# EAGLE schematic 1WireStamp-V01-006 (EAGLE 9.3.0)
MAPLE-CUx Large Version
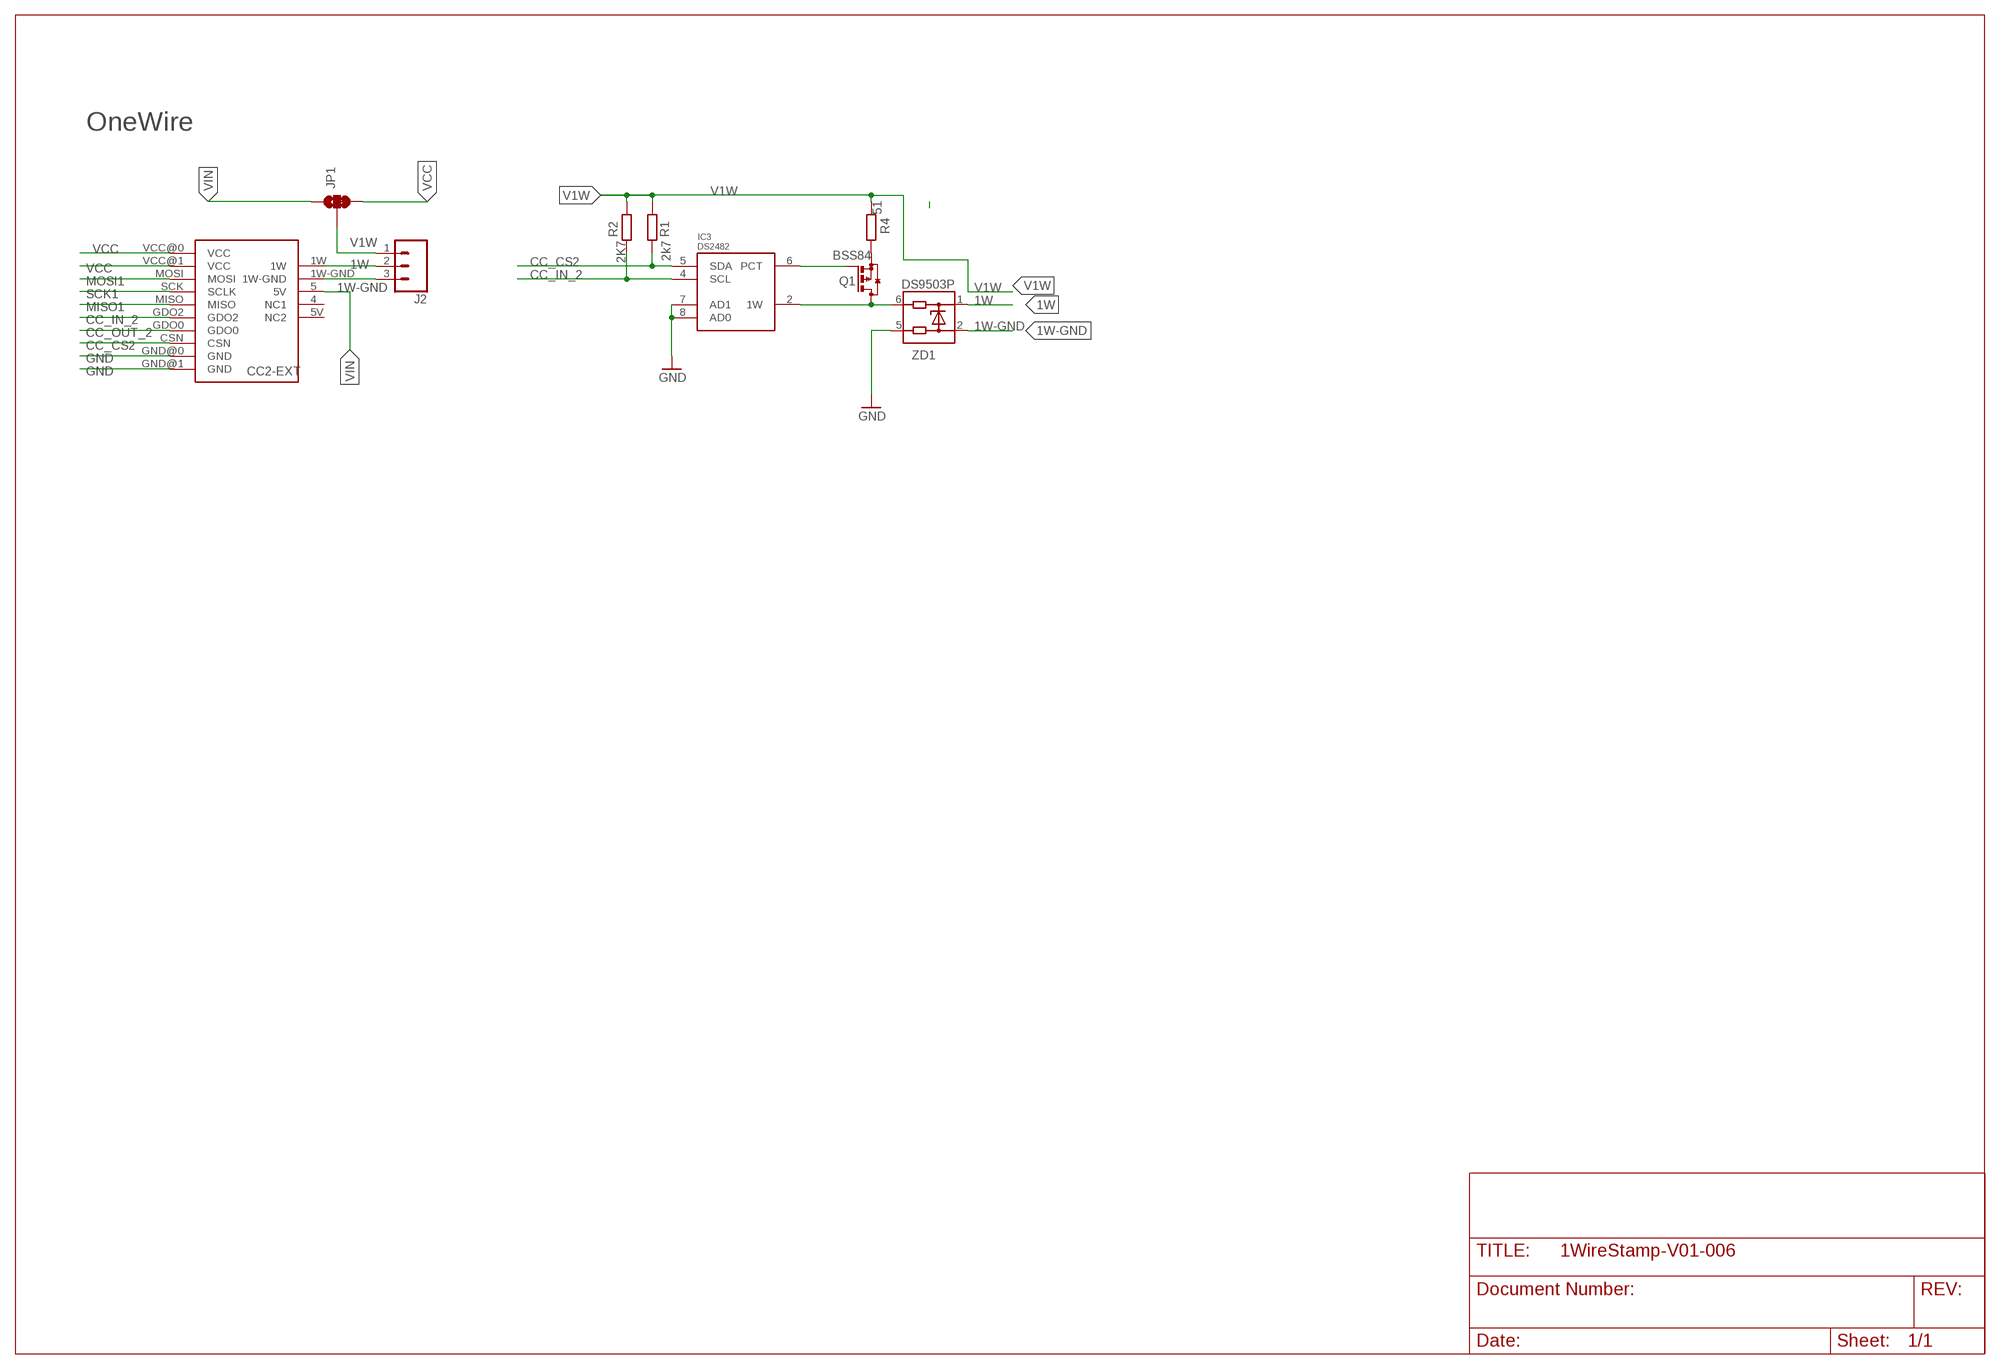
[diagram p0: schematic, sheet 1]

## Parts
CC2-EXT  ONEWIRE-MODULEONEWIRE_CC1101_WO-SILK  [ONEWIRE_CC1101_MOD_WO_SILK]
IC3  DS2482  DS2482-100S  [SO08]
J2  CONN_03LONGPADS  [1X03_LONGPADS]
JP1  JUMPER-SMT_3_1-NC_TRACE_SILK  [SMT-JUMPER_3_1-NC_TRACE_SILK]
Q1  BSS84  [SOT23]
R1  2k7  R-EU_R0805  [R0805]
R2  2K7  R-EU_R0805  [R0805]
R4  51  R-EU_R0805  [R0805]
ZD1  DS9503P  [TSOC6]

## Nets
1W: CC2-EXT.1W J2.2 ZD1.1
1W-GND: CC2-EXT.1W-GND J2.3 ZD1.2
CC_CS2: CC2-EXT.CSN IC3.5(SDA) R1.2
CC_IN_2: CC2-EXT.GDO2 IC3.4(SCL) R2.2
CC_OUT_2: CC2-EXT.GDO0
GND [Power]: CC2-EXT.GND@0(GND) CC2-EXT.GND@1(GND) IC3.7(AD1) IC3.8(AD0) ZD1.5
MISO1: CC2-EXT.MISO
MOSI1: CC2-EXT.MOSI
N$47: IC3.6(PCT) Q1.1(G)
N$48: IC3.2(1W) Q1.3(D) ZD1.6
N$52: Q1.2(S) R4.1
SCK1: CC2-EXT.SCK(SCLK)
V1W [Power]: J2.1 JP1.2 R1.1 R2.1 R4.2
VCC [Power]: CC2-EXT.VCC@0(VCC) CC2-EXT.VCC@1(VCC) JP1.3
VIN [Power]: CC2-EXT.5(5V) JP1.1
Unconnected: CC2-EXT.4(NC1) CC2-EXT.5V(NC2)

## Notes on the sheet
- OneWire

## Power pins joined to a net without a drawn wire
GND: IC3.3(GND)
VDD: IC3.1(VDD)

## Library data of the parts
CC2-EXT = CC1101:ONEWIRE-MODULE
IC3 = 1wire:DS2482-100: I2C to 1-Wire Host Adapter/Line Driver This device is a onewire host and I2C interface in one chip. It provides the complete DC/AC requirements for onewire communication, including overdrive speed mode, but, unlike the DS2480B chip, no 12V EPROM programming. Notes: For overdrive speed and 5V EEPROM programming, an external active pullup circuit must be connected to the 1W, VDD and PCT pin. See the datasheet for details. The lower two I2C adress bits of the chip can be selected by external pins, so up to 4 chips may be connected to the same I2C bus. Author: Orginal device and description from Giovanni Varasano <giovanni.varasano@fastwebnet.it> Improved by Jan Kandziora <jjj@gmx.de>
J2 = SparkFun-Connectors:CONN_03: Multi connection point. Often used as Generic Header-pin footprint for 0.1 inch spaced/style header connections On any of the 0.1 inch spaced packages, you can populate with these: Break Away Headers - Straight <https://www.sparkfun.com/products/116> (PRT-00116) Break Away Male Headers - Right Angle <https://www.sparkfun.com/products/553> (PRT-00553) Female Headers <https://www.sparkfun.com/products/115> (PRT-00115) Break Away Headers - Machine Pin <https://www.sparkfun.com/products/117> (PRT-00117) Break Away Female Headers - Swiss Machine Pin <https://www.sparkfun.com/products/743> (PRT-00743) Stackable Header - 3 Pin (Female, 0.1") <https://www.sparkfun.com/products/13875> (PRT-13875) For SCREWTERMINALS and SPRING TERMINALS visit here: Screw Terimnals on SparkFun.com <https://www.sparkfun.com/search/results?term=Screw+Terminals> (5mm/3.5mm/2.54mm spacing) This device is also useful as a general connection point to wire up your design to another part of your project. Our various solder wires solder well into these plated through hole pads. Hook-Up Wire - Assortment (Stranded, 22 AWG) <https://www.sparkfun.com/products/11375> (PRT-11375) Hook-Up Wire - Assortment (Solid Core, 22 AWG) <https://www.sparkfun.com/products/11367> (PRT-11367) View the entire wire category on our website here <https://www.sparkfun.com/categories/141> Special notes: Molex polarized connector foot print use with SKU : PRT-08232 with associated crimp pins and housings.
JP1 = SparkFun-Jumpers:JUMPER-SMT_3_1-NC_TRACE: Normally closed trace jumper (1 of 2 connections) This jumper has a trace between two pads so it's normally closed (NC). The other connection is normally open (NO). Use a razor knife to open the connection. For best results follow the IPC guidelines for cutting traces: Cutout at least 0.063 mm (0.005 in). Remove all loose material to clean up the cut area. Seal the cut with an approved epoxy. Reapply solder to reclose the connection, or to close the NO connection.
Q1 = transistor-small-signal:BSS84: P-CHANNEL MOS FET
R1 R2 R4 = rcl:R-EU_: RESISTOR, European symbol; SPICEPREFIX: R
ZD1 = 1wire:DS9503: ESD Protection Diode with Resistors This ESD protection diode is designed especially for onewire host interfaces. Unlike the DS9502, it has two additional 5Ohm resitors in the 1W and GND line. Pin 5 and 6 have to be connected to the host side, pin 1 und 2 to the network side. The 1W line is through pin 1 and 6, the GND line is through pin 2 and 5. Author: Jan Kandziora <jjj@gmx.de>

## Net classes
0 default: width 0.305 mm
1 Power: width 0.61 mm